# Altium project TSE_power_control_board.PrjPcb
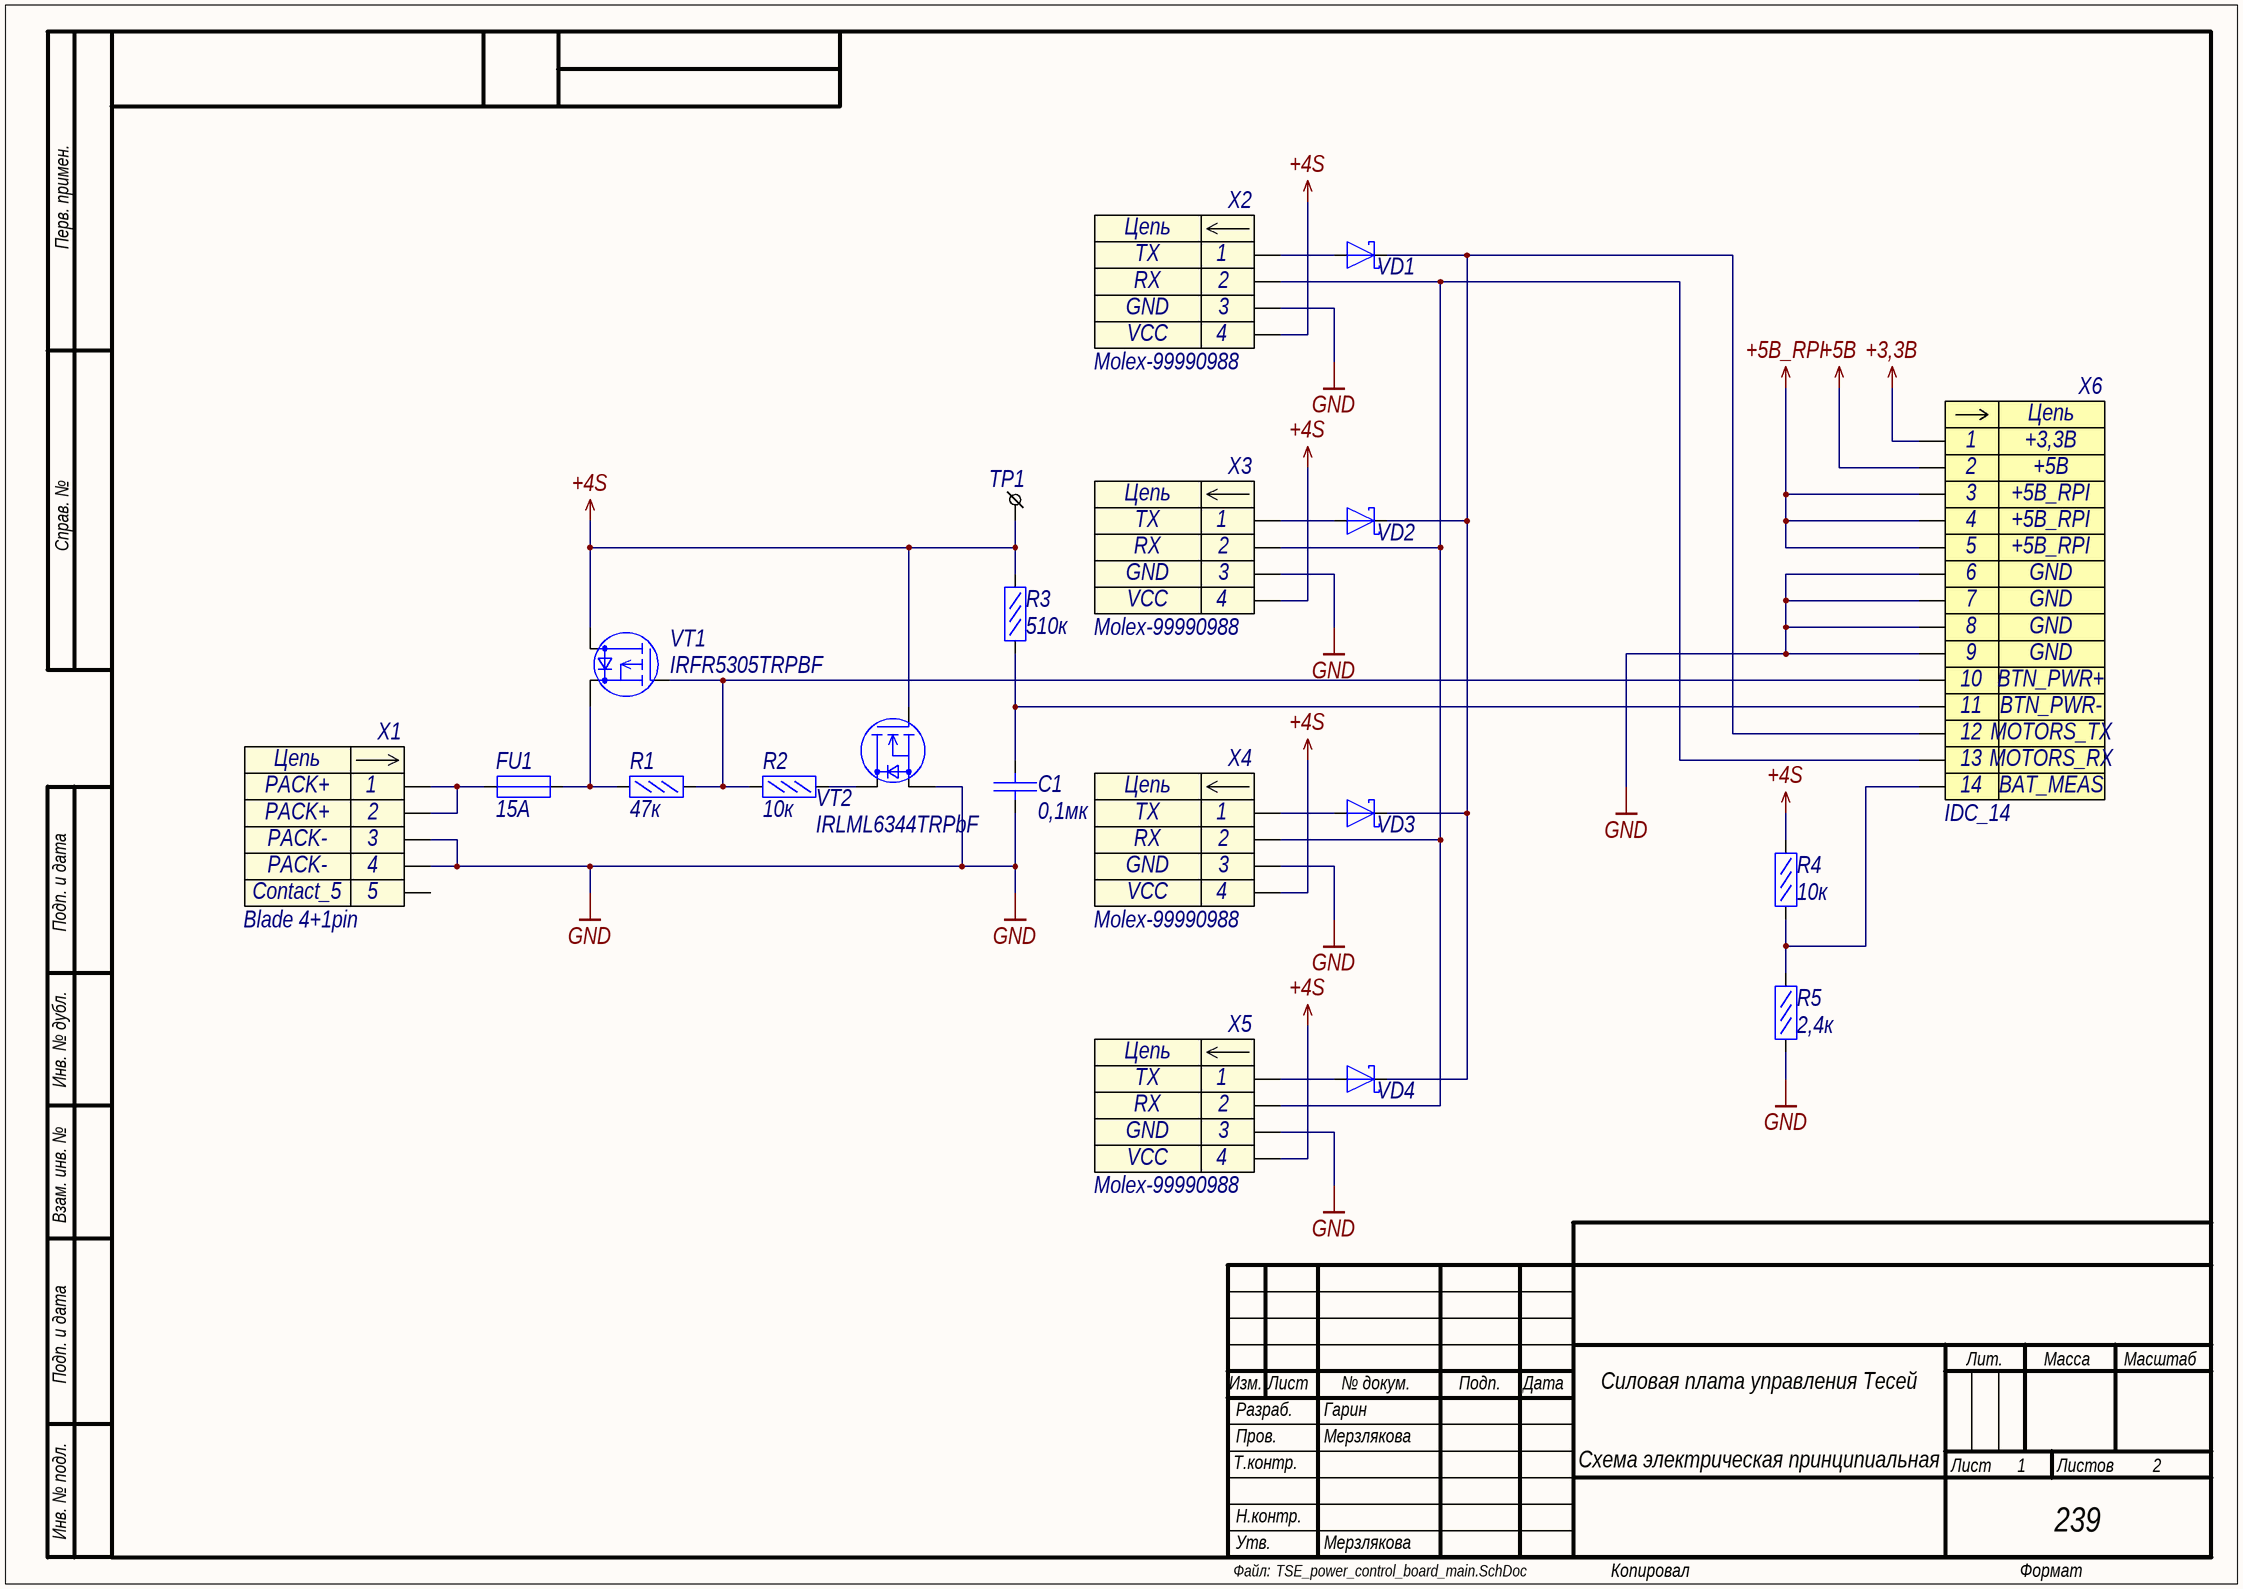
[diagram p0: TSE_power_control_board_main.SchDoc]
approver: Мерзлякова; company: 239; developer: Гарин; device_title: Силовая плата управления Тесей; document_code: Э3; document_type: Схема электрическая принципиальная; reviewer: Мерзлякова
2 sheets, 60 parts. Net scope: global (net labels, ports and power ports of the same name join across sheets).
Board file: TSE_power_control_board.PcbDoc
Sheets:
  TSE_power_control_board_main.SchDoc
  TSE_power_control_board_converters.SchDoc

## Sheet TSE_power_control_board_main.SchDoc
size 420 x 297 mm; SheetNumber: 1; SheetTotal: 2

### Parts
(Parts that share a designator on the sheet are numbered #1, #2 ... from top to bottom, then left to right.)
C1  0,1мк  [C0603]
FU1  15А  [FU2410]
R1  47к  [R0603]
R2  10к  [R0603]
R3  510к  [R0603]
R4  10к  [R0603]
R5  2,4к  [R0603]
TP1#1  +4S  [TP_0,6X1]  (value not drawn)  (no BOM)
VD1  1N5817WS  [SOD323]  (value not drawn)
VD2  1N5817WS  [SOD323]  (value not drawn)
VD3  1N5817WS  [SOD323]  (value not drawn)
VD4  1N5817WS  [SOD323]  (value not drawn)
VT1  IRFR5305TRPBF  [D-PAK]
VT2  IRLML6344TRPbF  [SOT23-3]
X1  Blade 4+1pin  [Blade 4+1P M]
X2  Molex-99990988  [Molex-99990988]
X3  Molex-99990988  [Molex-99990988]
X4  Molex-99990988  [Molex-99990988]
X5  Molex-99990988  [Molex-99990988]
X6  IDC_14  [IDC1.27_14]

### Nets
+3,3В: X6.1
+4S: R3.2 R4.2 TP1#1.1 VT1.2(D) VT2.1(G) X2.4 X3.4 X4.4 X5.4
+5В: X6.2
+5В_RPI: X6.3 X6.4 X6.5
GND: C1.1 R5.1 VT2.2(S) X1.3 X1.4 X2.3 X3.3 X4.3 X5.3 X6.6 X6.7 X6.8 X6.9
NetC1_2: C1.2 R3.1 X6.11
NetFU1_1: FU1.1 X1.1 X1.2
NetFU1_2: FU1.2 R1.1 VT1.3(S)
NetR1_2: R1.2 R2.2 VT1.1(G) X6.10
NetR2_1: R2.1 VT2.3(D)
NetR4_1: R4.1 R5.2 X6.14
NetVD1_1: VD1.1(K) VD2.1(K) VD3.1(K) VD4.1(K) X6.12
NetVD1_2: VD1.2(A) X2.1
NetVD2_2: VD2.2(A) X3.1
NetVD3_2: VD3.2(A) X4.1
NetVD4_2: VD4.2(A) X5.1
NetX2_2: X2.2 X3.2 X4.2 X5.2 X6.13

### Notes on the sheet
- Перв. примен.
- Справ. №
- Подп. и дата
- Инв. № дубл.
- Взам. инв. №
- Изм.
- Лист
- № докум.
- Подп.
- Дата
- Лит.
- Масса
- Масштаб
- Т.контр.
- Пров.
- Разраб.
- Листов
- Инв. № подл.
- Н.контр.
- Файл:
- Утв.
- Копировал
- Формат
- (in symbol Blade 4+1P M) Цепь; 5
- (in symbol IDC_14) Цепь
- (in symbol Molex-99990988) Цепь

### Library data of the parts
C1 = CC0603JPX7R9BB104: Конденсатор кер. 0,1мкФ 50В; Manufacturer: Yageo; TKE: X7R; Name: CC0603JPX7R9BB104; Value: 0,1мк
FU1 = fuse: Предохранитель SMD; Value: 15А
R1 = RC0603FR-0747KL: Резистор 47кОм 0,063Вт 1%; Manufacturer: YAGEO; Name: RC0603FR-0747KL; Tolerance: 1%; Value: 47к
R2 R4 = RC0603FR-0710KL: Резистор 10кОм 0,063Вт 1%; Manufacturer: YAGEO; Name: RC0603FR-0710KL; Tolerance: 1%; Value: 10к
R3 = RC0603FR-07510KL: Резистор 510кОм 0,1Вт 1%; Manufacturer: YAGEO; Name: RC0603FR-07510KL; Tolerance: 1%; Value: 510к
R5 = RC0603FR-072K4L: Резистор 2,4 кОм 0,1Вт 1%; Value: 2,4к
TP1#1 = TESTPOINT_HOLE: Name: +4S
VD1-VD4 = 1N5817WS: Диод Шоттки 1N5817WS 20V 1А 0.45V; Производитель: Hottech Co. Ltd; current: 1A; voltage: 20В; drop voltage: 0,45В; Name: 1N5817WS
VT1 = IRFR5305TRPBF: Транзистор полевой P-канальный -55В -31А 110Вт 0,065Ом; Name: IRFR5305TRPBF
VT2 = IRLML6344TRPbF: N-MOSFET 30В 5А; Наименование: IRLML6344TRPbF
X1 = Blade 4+1P M: Ножевой разъём - 4 конт. прямая вилка на плату с шагом 2.54мм; Contact_1: PACK+; Contact_3: PACK-; Contact_2: PACK+; Contact_4: PACK-; Наименование: Blade 4+1pin; Contact_5: Contact_5
X2-X5 = Molex-99990988: Разъем - 4 конт. прямая вилка на плату, шаг 2,50 мм; Contact_1: TX; Contact_2: RX; Contact_3: GND; Contact_4: VCC; Наименование: Molex-99990988
X6 = IDC_14: Разъем - 14 конт. прямая вилка на плату; Contact_1: +3,3В; Contact_2: +5В; Contact_3: +5В_RPI; Contact_6: GND; Contact_10: BTN_PWR+; Contact_11: BTN_PWR-; Contact_12: MOTORS_TX; Contact_13: MOTORS_RX; Contact_14: BAT_MEAS; Наименование: IDC_14; Contact_4: +5В_RPI; Contact_5: +5В_RPI; Contact_7: GND; Contact_8: GND; Contact_9: GND

## Sheet TSE_power_control_board_converters.SchDoc
size 420 x 297 mm; SheetNumber: 2; SheetTotal: 2
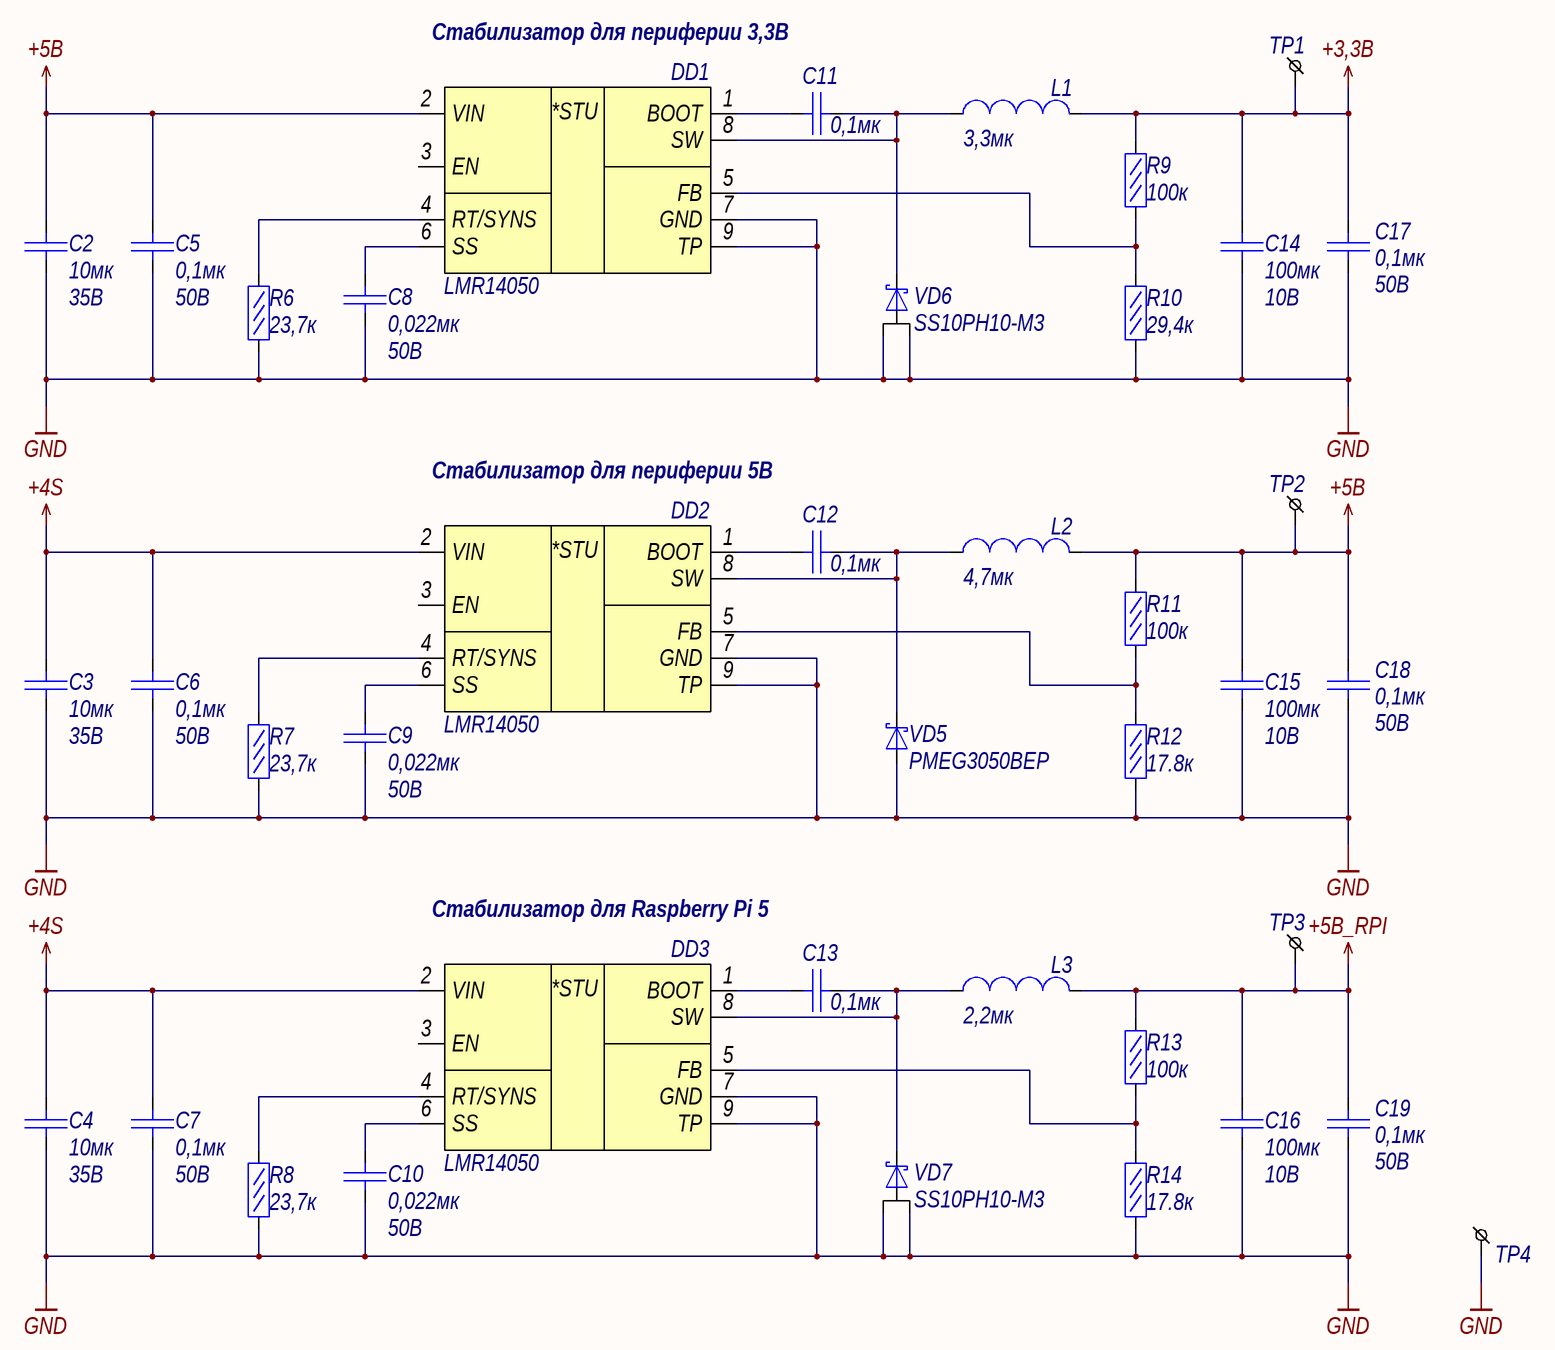
[diagram p1: TSE_power_control_board_converters.SchDoc]

### Parts
(Parts that share a designator on the sheet are numbered #1, #2 ... from top to bottom, then left to right.)
C2  Voltage: 35В  [C1210]  (hidden comment: 10мк)
C3  Voltage: 35В  [C1210]  (hidden comment: 10мк)
C4  Voltage: 35В  [C1210]  (hidden comment: 10мк)
C5  Voltage: 50В  [C0603]  (hidden comment: 0,1мк)
C6  Voltage: 50В  [C0603]  (hidden comment: 0,1мк)
C7  Voltage: 50В  [C0603]  (hidden comment: 0,1мк)
C8  Voltage: 50В  [C0603]  (hidden comment: 0,022мк)
C9  Voltage: 50В  [C0603]  (hidden comment: 0,022мк)
C10  Voltage: 50В  [C0603]  (hidden comment: 0,022мк)
C11  0,1мк  [C0603]
C12  0,1мк  [C0603]
C13  0,1мк  [C0603]
C14  Voltage: 10В  [C1210]  (hidden comment: 100мк)
C15  Voltage: 10В  [C1210]  (hidden comment: 100мк)
C16  Voltage: 10В  [C1210]  (hidden comment: 100мк)
C17  Voltage: 50В  [C0603]  (hidden comment: 0,1мк)
C18  Voltage: 50В  [C0603]  (hidden comment: 0,1мк)
C19  Voltage: 50В  [C0603]  (hidden comment: 0,1мк)
DD1  LMR14050  [SO-8PP]
DD2  LMR14050  [SO-8PP]
DD3  LMR14050  [SO-8PP]
L1  3,3мк  [2525]
L2  4,7мк  [2525]
L3  2,2мк  [2525]
R6  23,7к  [R0603]
R7  23,7к  [R0603]
R8  23,7к  [R0603]
R9  100к  [R0603]
R10  29,4к  [R0603]
R11  100к  [R0603]
R12  17.8к  [R0603]
R13  100к  [R0603]
R14  17.8к  [R0603]
TP1#2  +3,3В  [TP_0,6X1]  (value not drawn)  (no BOM)
TP2  +5В  [TP_0,6X1]  (value not drawn)  (no BOM)
TP3  +5В_RPI  [TP_0,6X1]  (value not drawn)  (no BOM)
TP4  GND  [TP_0,6X1]  (value not drawn)  (no BOM)
VD5  PMEG3050BEP  [SOD128]
VD6  SS10PH10-M3  [TO-277A]
VD7  SS10PH10-M3  [TO-277A]

### Nets
+3,3В: C14.2 C17.2 L1.2 R9.2 TP1#2.1
+4S: C3.2 C4.2 C6.2 C7.2 DD2.2(VIN) DD3.2(VIN)
+5В: C2.2 C5.2 C15.2 C18.2 DD1.2(VIN) L2.2 R11.2 TP2.1
+5В_RPI: C16.2 C19.2 L3.2 R13.2 TP3.1
GND: C2.1 C3.1 C4.1 C5.1 C6.1 C7.1 C8.1 C9.1 C10.1 C14.1 C15.1 C16.1 C17.1 C18.1 C19.1 DD1.7(GND) DD1.9(TP) DD2.7(GND) DD2.9(TP) DD3.7(GND) DD3.9(TP) R6.1 R7.1 R8.1 R10.1 R12.1 R14.1 TP4.1 VD5.2(A) VD6.1(A) VD6.2(A) VD7.1(A) VD7.2(A)
NetC8_2: C8.2 DD1.6(SS)
NetC9_2: C9.2 DD2.6(SS)
NetC10_2: C10.2 DD3.6(SS)
NetC11_1: C11.1 DD1.8(SW) L1.1 VD6.3(K)
NetC11_2: C11.2 DD1.1(BOOT)
NetC12_1: C12.1 DD2.8(SW) L2.1 VD5.1(K)
NetC12_2: C12.2 DD2.1(BOOT)
NetC13_1: C13.1 DD3.8(SW) L3.1 VD7.3(K)
NetC13_2: C13.2 DD3.1(BOOT)
NetDD1_4: DD1.4(RT/SYNS) R6.2
NetDD1_5: DD1.5(FB) R9.1 R10.2
NetDD2_4: DD2.4(RT/SYNS) R7.2
NetDD2_5: DD2.5(FB) R11.1 R12.2
NetDD3_4: DD3.4(RT/SYNS) R8.2
NetDD3_5: DD3.5(FB) R13.1 R14.2

Not connected (* = marked no-connect by the designer): DD1 3(EN); DD2 3(EN); DD3 3(EN)

### Notes on the sheet
- Стабилизатор для периферии 3,3В
- Стабилизатор для периферии 5В
- Стабилизатор для Raspberry Pi 5
- Подп. и дата
- Инв. № дубл.
- Взам. инв. №
- Инв. № подл.
- Лист
- Файл:
- Изм.
- № докум.
- Подп.
- Дата
- Копировал
- Формат
- (in symbol LMR14050) *STU

### Library data of the parts
C2-C4 = CL32A106KATLNNE: Конденсатор кер. 10мкФ 35В; Manufacturer: Yageo; Name: CC1206KKX7R8BB106; TKE: X7R; Value: 10мк
C5-C7 C11-C13 C17-C19 = CC0603JPX7R9BB104: as C1 on sheet TSE_power_control_board_main; Name: CC0603JPX7R9BB104; Value: 0,1мк
C8-C10 = CC0603JRX7R9BB223: Конденсатор кер. 0,022мкФ 50В; Manufacturer: Yageo; TKE: X7R; Name: CC0603JRX7R9BB223; Value: 0,022мк
C14-C16 = CL32A107MPVNNNE: Конденсатор кер. 100мкФ 10В; Manufacturer: EPCOS; Name: B41858C6107; ESR: 0,6Ом; Value: 100мк
DD1-DD3 = LMR14050: Понижающий DC/DC преобразователь Uвх=40В, Iвых=5А; Manufacturer: Texas Instruments; Name: LMR14050
L1 = IHLP2525CZER3R3M01: Катушка индуктивности 3,3мкГн 6А; I saturation: 3,2; R: 0,050; Value: 3,3мк
L2 = IHLP2525CZER4R7M01: Катушка индуктивности 4,7мкГн 5,5А; I saturation: 3,2; R: 0,050; Value: 4,7мк
L3 = IHLP2525CZER2R2M01: Катушка индуктивности 2,2мкГн 8А; I saturation: 3,2; R: 0,050; Value: 2,2мк
R6-R8 = RC0603FR-0723K7L: Резистор 23,7 кОм 0,1Вт 1%; Value: 23,7к
R9 R11 R13 = RC0603FR-07100KL: Резистор 100кОм 0,1Вт 1%; Manufacturer: YAGEO; Name: RC0603FR-07100KL; Tolerance: 1%; Value: 100к
R10 = RC0603FR-0729K4L: Резистор 29,4 кОм 0,1Вт 1%; Value: 29,4к
R12 R14 = RC0603FR-0717K8L: Резистор 17,8 кОм 0,1Вт 1%; Value: 17.8к
TP1#2 TP2-TP4 = TESTPOINT_HOLE
  TP1#2: Name: +3,3В
  TP2: Name: +5В
  TP3: Name: +5В_RPI
  TP4: Name: GND
VD5 = PMEG3050BEP: Диод Шоттки 30В 5А; Manufacturer: NXP; Name: PMEG3050BEP
VD6 VD7 = SS10PH10-M3: Диод Шоттки 100В 10А; Manufacturer: Vishay; Name: SS10PH10-M3

## Nets that join several sheets
+3,3В: TSE_power_control_board_main (X6.1), TSE_power_control_board_converters (5 pins)
+4S: TSE_power_control_board_main (9 pins), TSE_power_control_board_converters (6 pins)
+5В: TSE_power_control_board_main (X6.2), TSE_power_control_board_converters (8 pins)
+5В_RPI: TSE_power_control_board_main (X6.3 X6.4 X6.5), TSE_power_control_board_converters (5 pins)
GND: TSE_power_control_board_main (13 pins), TSE_power_control_board_converters (33 pins)